# EAGLE schematic LSS Pro V0.2 BOTTOM (EAGLE 7.6.0)
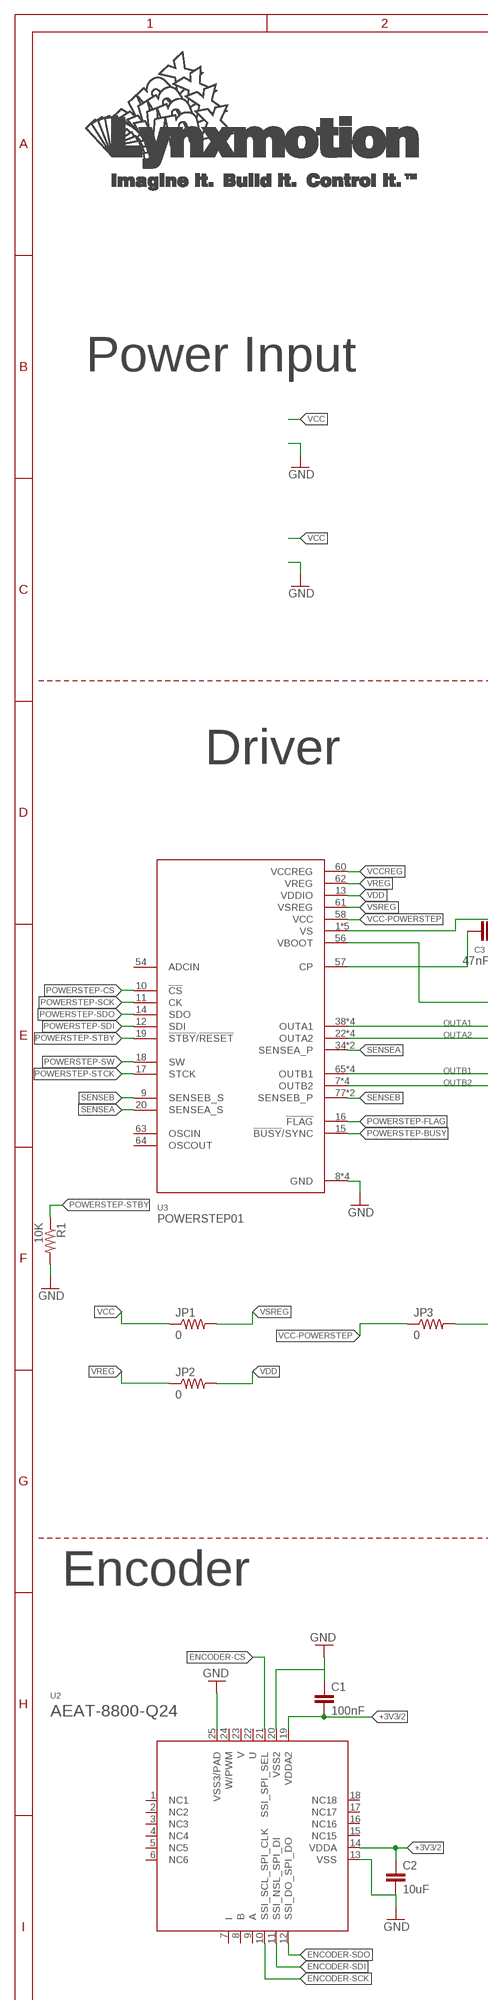
[diagram p0: schematic, sheet 1, part 1 of 2]
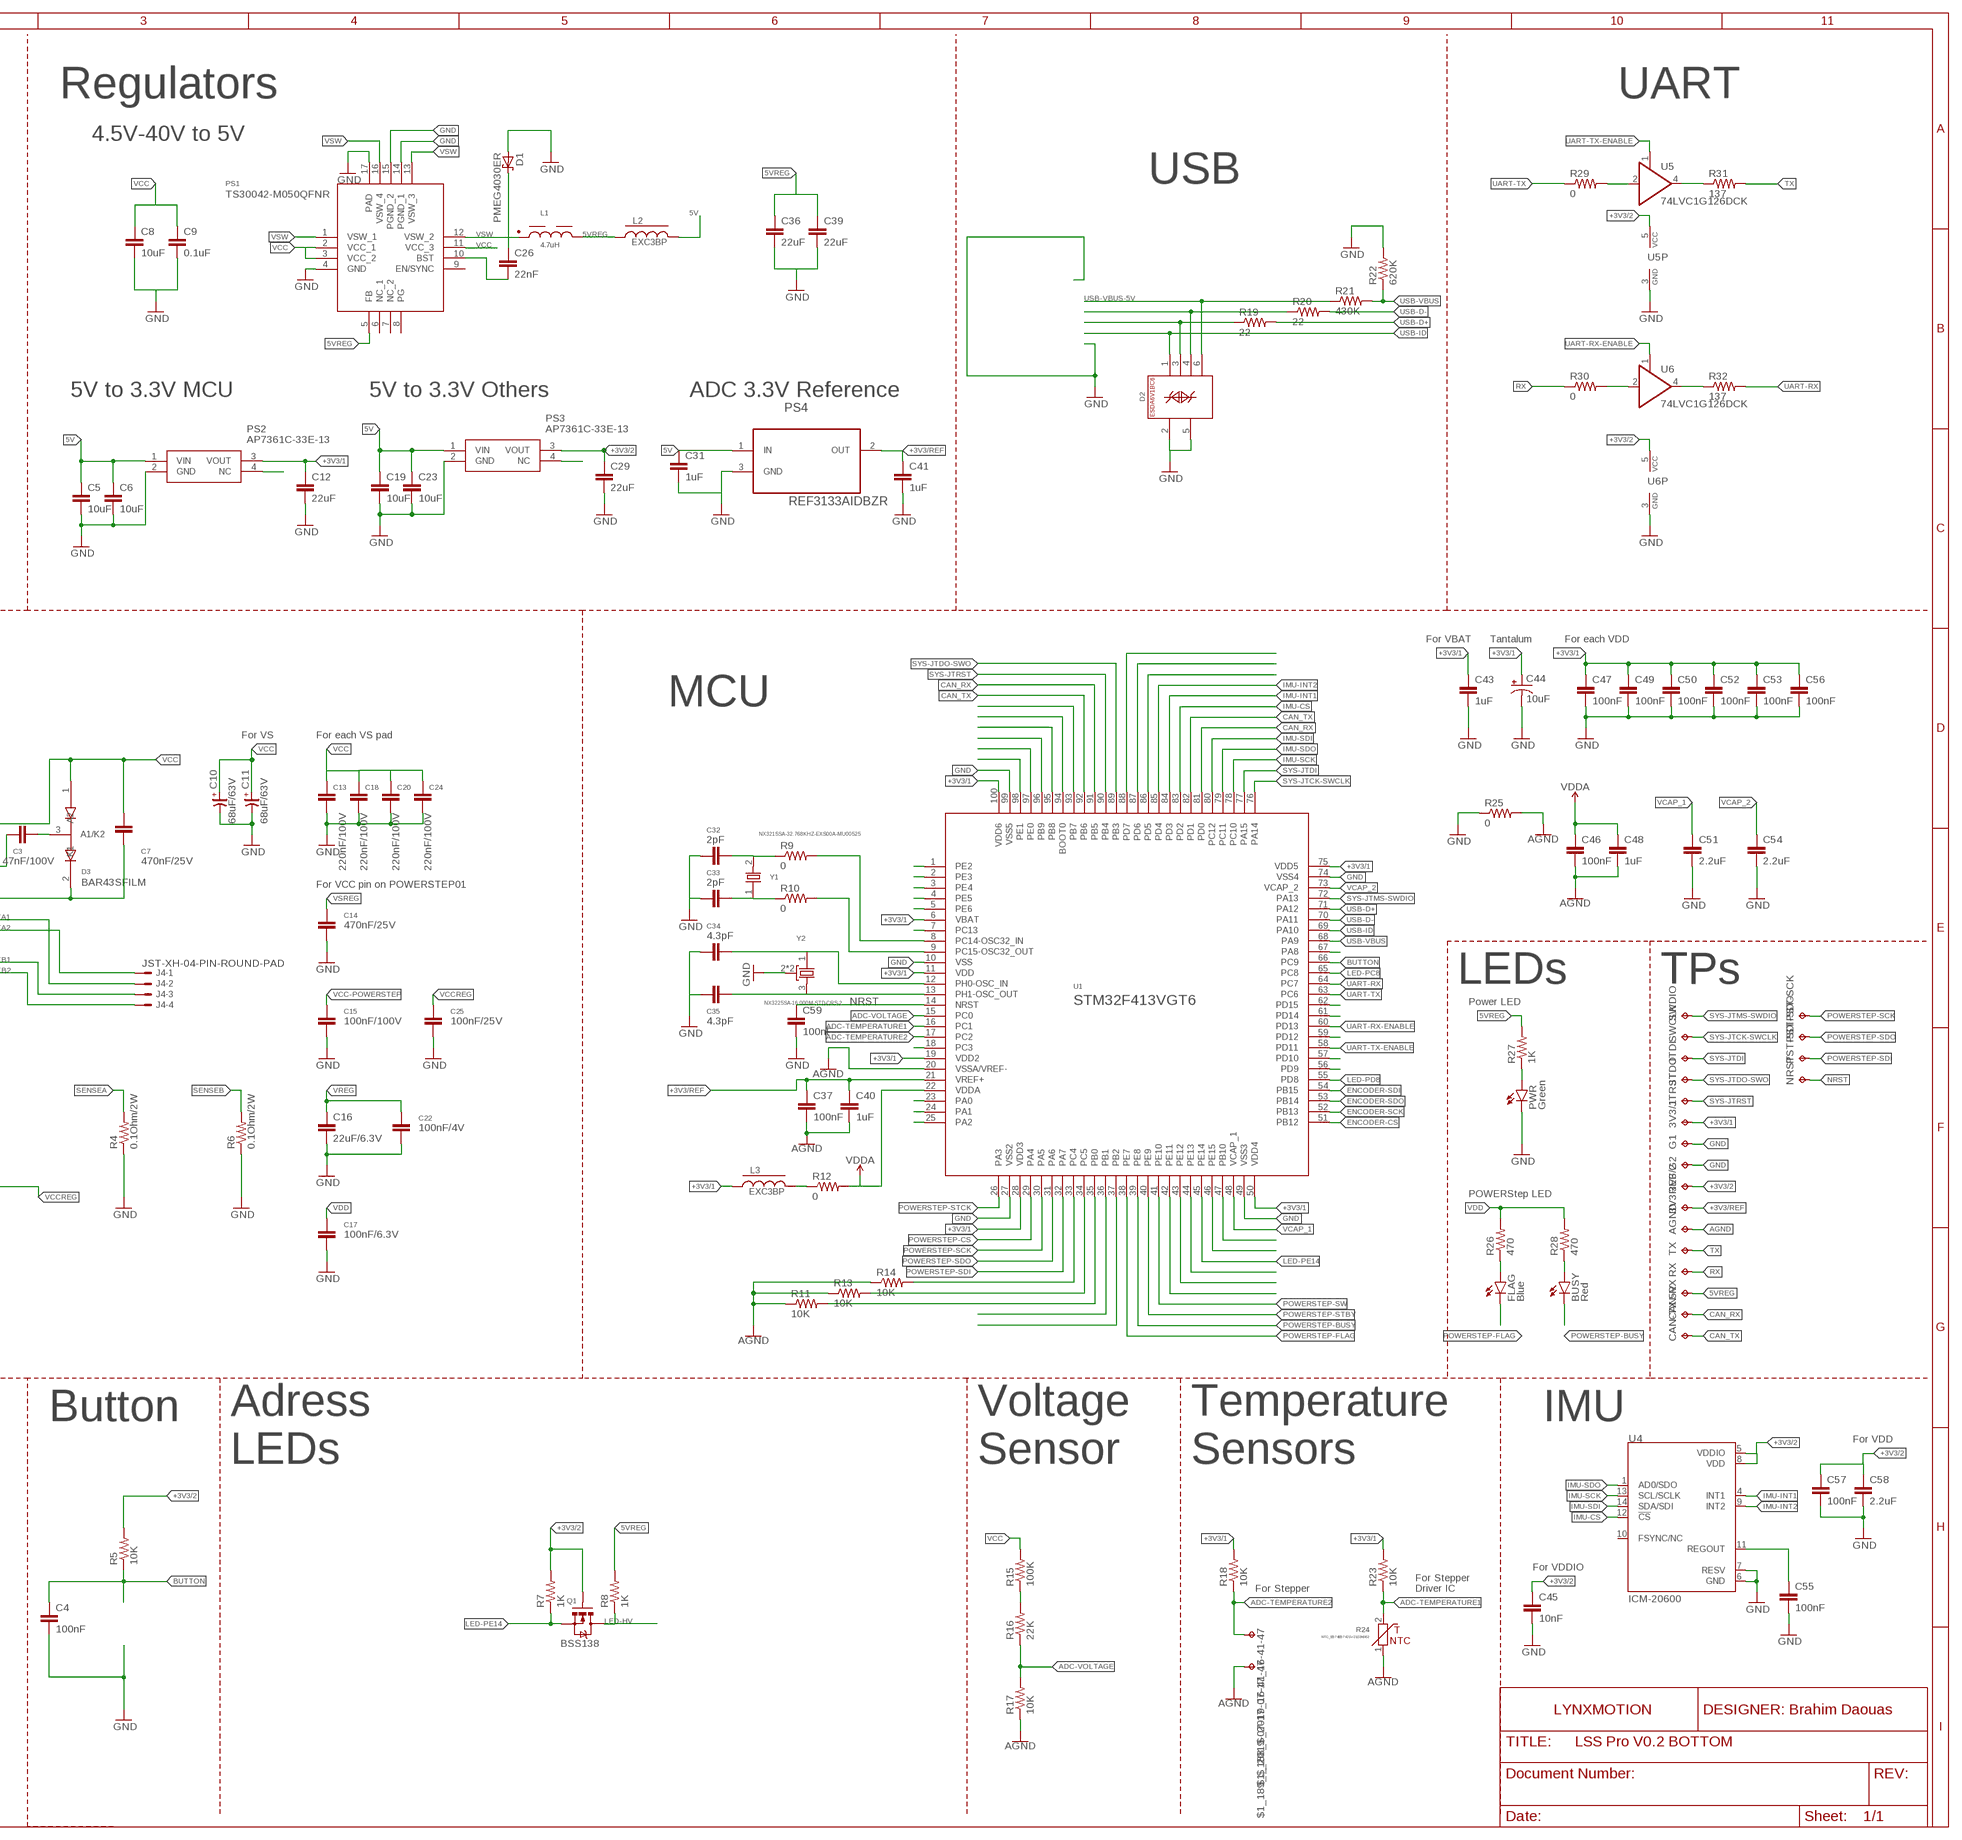
[diagram p1: schematic, sheet 1, part 2 of 2]

## Parts
3V3/1  TPTP17R  [TP17R]
3V3/2  TPTP17R  [TP17R]
3V3REF  TPTP17R  [TP17R]
5V  TPTP17R  [TP17R]
$1_188_$_2019-07-17_16-41-47  TP-040  [TP-040]
$1_189_$_2019-07-17_16-41-47  TP-040  [TP-040]
AGND  TPTP17R  [TP17R]
BUSY  Red  LED0603  [LED-0603]
C1  100nF  CAP0603-CAP  [0603-CAP]
C2  10uF  CAP0603-CAP  [0603-CAP]
C3  47nF/100V  CAP0805  [0805]
C4  100nF  CAP0603-CAP  [0603-CAP]
C5  10uF  CAP0805  [0805]
C6  10uF  CAP0805  [0805]
C7  470nF/25V  CAP0603-CAP  [0603-CAP]
C8  10uF  CAP1206  [1206]
C9  0.1uF  CAP0603-CAP  [0603-CAP]
C10  68uF/63V  CP_SV-E/F  [CSV-E/F]
C11  68uF/63V  CP_SV-E/F  [CSV-E/F]
C12  22uF  CAP0805  [0805]
C13  220nF/100V  CAP0805  [0805]
C14  470nF/25V  CAP0603-CAP  [0603-CAP]
C15  100nF/100V  CAP0603-CAP  [0603-CAP]
C16  22uF/6.3V  CAP1206  [1206]
C17  100nF/6.3V  CAP0603-CAP  [0603-CAP]
C18  220nF/100V  CAP0805  [0805]
C19  10uF  CAP0805  [0805]
C20  220nF/100V  CAP0805  [0805]
C22  100nF/4V  CAP0603-CAP  [0603-CAP]
C23  10uF  CAP0805  [0805]
C24  220nF/100V  CAP0805  [0805]
C25  100nF/25V  CAP0603-CAP  [0603-CAP]
C26  22nF  CAP0402-CAP  [0402-CAP]
C29  22uF  CAP0805  [0805]
C31  1uF  CAP0805  [0805]
C32  2pF  CAP0603-CAP  [0603-CAP]
C33  2pF  CAP0603-CAP  [0603-CAP]
C34  4.3pF  CAP0603-CAP  [0603-CAP]
C35  4.3pF  CAP0603-CAP  [0603-CAP]
C36  22uF  CAP0805  [0805]
C37  100nF  CAP0603-CAP  [0603-CAP]
C39  22uF  CAP0805  [0805]
C40  1uF  CAP0603-CAP  [0603-CAP]
C41  1uF  CAP0805  [0805]
C43  1uF  CAP0603-CAP  [0603-CAP]
C44  10uF  CAP_POL1206  [EIA3216]
C45  10nF  CAP0603-CAP  [0603-CAP]
C46  100nF  CAP0603-CAP  [0603-CAP]
C47  100nF  CAP0603-CAP  [0603-CAP]
C48  1uF  CAP0603-CAP  [0603-CAP]
C49  100nF  CAP0603-CAP  [0603-CAP]
C50  100nF  CAP0603-CAP  [0603-CAP]
C51  2.2uF  CAP1206  [1206]
C52  100nF  CAP0603-CAP  [0603-CAP]
C53  100nF  CAP0603-CAP  [0603-CAP]
C54  2.2uF  CAP1206  [1206]
C55  100nF  CAP0603-CAP  [0603-CAP]
C56  100nF  CAP0603-CAP  [0603-CAP]
C57  100nF  CAP0603-CAP  [0603-CAP]
C58  2.2uF  CAP1206  [1206]
C59  100nF  CAP0603-CAP  [0603-CAP]
CAN-RX  TPTP17R  [TP17R]
CAN-TX  TPTP17R  [TP17R]
D1  PMEG4030ER  [SOD123W]
D2  ESDA6V1BC6  [SOT-23-6L]
D3  BAR43SFILM  [SOT105P242X150-3N]
FLAG  Blue  LED0603  [LED-0603]
G1  TPTP17R  [TP17R]
G2  TPTP17R  [TP17R]
J4  JST-XH-04-PIN-ROUND-PAD  [JST-XH-04-PACKAGE-ROUND-PAD]
JP1  0  RESISTOR0603  [0603-RES]
JP2  0  RESISTOR0603  [0603-RES]
JP3  0  RESISTOR0603  [0603-RES]
JTDI  TPTP17R  [TP17R]
JTDO  TPTP17R  [TP17R]
JTRST  TPTP17R  [TP17R]
L1  4.7uH  WE-PD2_5848_744774047  [WE-PD2_5848/5820]
L2  EXC3BP  [L0603]
L3  EXC3BP  [L0603]
NRST  TPTP17R  [TP17R]
PS1  TS30042-M050QFNR  [QFN16]
PS2  AP7361C-33E-13  [SOT230P700X165-4N]
PS3  AP7361C-33E-13  [SOT230P700X165-4N]
PS4  REF3133AIDBZR  [SOT95P237X112-3N]
PST-SCK  TPTP17R  [TP17R]
PST-SDI  TPTP17R  [TP17R]
PST-SDO  TPTP17R  [TP17R]
PWR  Green  LED0603  [LED-0603]
Q1  BSS138  MOSFET-NCHANNELSMD  [SOT23-3]
R1  10K  RESISTOR0402-RES  [0402-RES]
R4  0.1Ohm/2W  RESISTOR2512  [R2512]
R5  10K  RESISTOR0603  [0603-RES]
R6  0.1Ohm/2W  RESISTOR2512  [R2512]
R7  1K  RESISTOR0603-RES  [0603-RES]
R8  1K  RESISTOR0603-RES  [0603-RES]
R9  0  RESISTOR0603  [0603-RES]
R10  0  RESISTOR0603  [0603-RES]
R11  10K  RESISTOR0402-RES  [0402-RES]
R12  0  RESISTOR0603  [0603-RES]
R13  10K  RESISTOR0402-RES  [0402-RES]
R14  10K  RESISTOR0402-RES  [0402-RES]
R15  100K  RESISTOR0603-RES  [0603-RES]
R16  22K  RESISTOR0603-RES  [0603-RES]
R17  10K  RESISTOR0603-RES  [0603-RES]
R18  10K  10KOHM-1/10W-1%(0603)0603  [0603-RES]
R19  22  RESISTOR0603  [0603-RES]
R20  22  RESISTOR0603  [0603-RES]
R21  430K  RESISTOR0603  [0603-RES]
R22  620K  RESISTOR0603  [0603-RES]
R23  10K  10KOHM-1/10W-1%(0603)0603  [0603-RES]
R24  NTC_B574B57421V2102H062  [R0805]
R25  0  RESISTOR0603  [0603-RES]
R26  470  RESISTOR0402-RES  [0402-RES]
R27  1K  RESISTOR0402-RES  [0402-RES]
R28  470  RESISTOR0402-RES  [0402-RES]
R29  0  RESISTOR0603  [0603-RES]
R30  0  RESISTOR0603  [0603-RES]
R31  137  RESISTOR0603  [0603-RES]
R32  137  RESISTOR0603  [0603-RES]
RX  TPTP17R  [TP17R]
SWCLK  TPTP17R  [TP17R]
SWDIO  TPTP17R  [TP17R]
TX  TPTP17R  [TP17R]
U1  STM32F413VGT6  [LQFP100]
U2  AEAT-8800-Q24  [QFN24]
U3  POWERSTEP01  [IC_POWERSTEP01]
U4  ICM-20600  [PQFN50P250X300X97-14N]
U5  74LVC1G126DCK  [SC70-5]
U6  74LVC1G126DCK  [SC70-5]
Y1  NX3215SA-32.768KHZ-EXS00A-MU00525  [NX3215SA]
Y2  NX3225SA-16.000M-STD-CRS-2  [OSCCC320X250X60N]

## Nets
5V: C5.1 C6.1 C19.1 C23.1 C31.1 L2.2 PS2.1(VIN) PS3.1(VIN) PS4.1(IN)
5VREG: 5V.TP C36.1 C39.1 L1.2 L2.1 PS1.5(FB) R8.2 R27.2
+3V3/1: 3V3/1.TP C12.1 C43.1 C44.A(+) C47.1 C49.1 C50.1 C52.1 C53.1 C56.1 L3.1 PS2.3(VOUT) R18.2 R23.2 U1.6(VBAT) U1.11(VDD) U1.19(VDD2) U1.28(VDD3) U1.50(VDD4) U1.75(VDD5) U1.100(VDD6)
+3V3/2: 3V3/2.TP C1.2 C2.1 C29.1 C45.1 C57.1 C58.1 PS3.3(VOUT) Q1.1(G) R5.2 R7.2 U2.14(VDDA) U2.19(VDDA2) U4.5(VDDIO) U4.8(VDD) U5.5(VCC) U6.5(VCC)
+3V3/REF: 3V3REF.TP C37.1 C40.1 C41.1 PS4.2(OUT) U1.21(VREF+)
ADC-TEMPERATURE1: R23.1 R24.2 U1.16(PC1)
ADC-TEMPERATURE2: $1_188_$_2019-07-17_16-41-47.1 R18.1 U1.17(PC2)
ADC-VOLTAGE: R16.1 R17.2 U1.15(PC0)
AGND: $1_189_$_2019-07-17_16-41-47.1 AGND.TP C37.2 C40.2 C46.2 C48.2 R11.1 R13.1 R14.1 R17.1 R24.1 R25.2 U1.20(VSSA/VREF-)
BUTTON: C4.1 R5.1 U1.66(PC9)
CAN_RX: CAN-RX.TP U1.81(PD0) U1.91(PB5)
CAN_TX: CAN-TX.TP U1.82(PD1) U1.92(PB6)
ENCODER-CS: U1.51(PB12) U2.21(SSI_SPI_SEL)
ENCODER-SCK: U1.52(PB13) U2.10(SSI_SCL_SPI_CLK)
ENCODER-SDI: U1.54(PB15) U2.11(SSI_NSL_SPI_DI)
ENCODER-SDO: U1.53(PB14) U2.12(SSI_DO_SPI_DO)
GND: C1.1 C2.2 C4.2 C5.2 C6.2 C8.2 C9.2 C10.- C11.- C12.2 C13.2 C14.2 C15.2 C16.2 C17.2 C18.2 C19.2 C20.2 C22.2 C23.2 C24.2 C25.2 C29.2 C31.2 C32.2 C33.2 C34.2 C35.2 C36.2 C39.2 C41.2 C43.2 C44.C(-) C45.2 C47.2 C49.2 C50.2 C51.2 C52.2 C53.2 C54.2 C55.2 C56.2 C57.2 C58.2 C59.2 D1.2(A) D2.2 D2.5 G1.TP G2.TP PS1.4(GND) PS1.14(PGND_1) PS1.15(PGND_2) PS1.17(PAD) PS2.2(GND) PS3.2(GND) PS4.3(GND) PWR.C R1.2 R4.1 R6.1 R22.2 R25.1 U1.10(VSS) U1.27(VSS2) U1.49(VSS3) U1.74(VSS4) U1.99(VSS5) U2.13(VSS) U2.20(VSS2) U2.25(VSS3/PAD) U3.8(GND) U3.21(GND) U3.59(GND) U3.EPAD9(GND) U4.6(GND) U4.7(RESV) U5.3(GND) U6.3(GND) Y2.2(GND) Y2.4(GND)
IMU-CS: U1.83(PD2) U4.12(!CS)
IMU-INT1: U1.84(PD3) U4.4(INT1)
IMU-INT2: U1.85(PD4) U4.9(INT2)
IMU-SCK: U1.78(PC10) U4.13(SCL/SCLK)
IMU-SDI: U1.80(PC12) U4.14(SDA/SDI)
IMU-SDO: U1.79(PC11) U4.1(AD0/SDO)
LED-HV: Q1.3(D) R8.1
LED-PC8: U1.65(PC8)
LED-PD8: U1.55(PD8)
LED-PE14: Q1.2(S) R7.1 U1.45(PE14)
N$1: U1.1(PE2)
N$2: U1.2(PE3)
N$3: U1.3(PE4)
N$4: U1.4(PE5)
N$5: U1.5(PE6)
N$6: R30.2 U6.2(I)
N$7: U1.7(PC13)
N$8: R9.2 U1.8(PC14-OSC32_IN)
N$9: R10.2 U1.9(PC15-OSC32_OUT)
N$10: L3.2 R12.1
N$11: R32.1 U6.4(O)
N$12: C34.1 U1.12(PH0-OSC_IN) Y2.1
N$13: C35.1 U1.13(PH1-OSC_OUT) Y2.3
N$15: PWR.A R27.1
N$18: U1.18(PC3)
N$20: R29.2 U5.2(I)
N$21: U1.37(PB2)
N$22: R31.1 U5.4(O)
N$23: U1.23(PA0)
N$24: U1.24(PA1)
N$25: U1.25(PA2)
N$27: C32.1 R9.1 Y1.2
N$28: C33.1 R10.1 Y1.1
N$29: FLAG.A R26.1
N$34: U1.67(PA8)
N$36: C3.1 U3.57(CP)
N$37: R15.1 R16.2
N$39: U1.62(PD15)
N$40: U1.61(PD14)
N$42: U1.59(PD12)
N$44: U1.57(PD10)
N$45: U1.56(PD9)
N$46: C55.1 U4.11(REGOUT)
N$47: BUSY.A R28.1
N$48: D2.4 R20.1
N$49: D2.3 R19.1
N$53: PS2.4(NC)
N$54: PS3.4(NC)
N$61: U1.86(PD5)
N$62: U1.87(PD6)
N$63: U1.88(PD7)
N$66: U1.98(PE1)
N$67: U1.97(PE0)
N$68: U1.96(PB9)
N$69: U1.95(PB8)
N$70: U1.94(BOOT0)
N$71: U1.93(PB7)
N$78: C3.2 D3.3(A1/K2)
N$83: R14.2 U1.33(PC4)
N$84: R13.2 U1.34(PC5)
N$85: R11.2 U1.35(PB0)
N$86: U1.36(PB1)
N$89: C7.2 D3.2(K1) U3.56(VBOOT)
N$92: U1.47(PB10)
N$93: U1.46(PE15)
N$95: U1.44(PE13)
N$96: U1.43(PE12)
N$97: U1.42(PE11)
N$101: C26.2 PS1.10(BST)
NRST: C59.1 NRST.TP U1.14(NRST)
OUTA1: J4.2 U3.38(OUTA1) U3.42(OUTA1) U3.53(OUTA1) U3.EPAD4(OUTA1)
OUTA2: J4.1 U3.22(OUTA2) U3.33(OUTA2) U3.37(OUTA2) U3.EPAD3(OUTA2)
OUTB1: J4.3 U3.65(OUTB1) U3.76(OUTB1) U3.80(OUTB1) U3.EPAD7(OUTB1)
OUTB2: J4.4 U3.7(OUTB2) U3.81(OUTB2) U3.85(OUTB2) U3.EPAD8(OUTB2)
POWERSTEP-BUSY: BUSY.C U1.39(PE8) U3.15(!BUSY!/SYNC)
POWERSTEP-CS: U1.29(PA4) U3.10(!CS)
POWERSTEP-FLAG: FLAG.C U1.38(PE7) U3.16(!FLAG)
POWERSTEP-SCK: PST-SCK.TP U1.30(PA5) U3.11(CK)
POWERSTEP-SDI: PST-SDI.TP U1.32(PA7) U3.12(SDI)
POWERSTEP-SDO: PST-SDO.TP U1.31(PA6) U3.14(SDO)
POWERSTEP-STBY: R1.1 U1.40(PE9) U3.19(!STBY!/!RESET)
POWERSTEP-STCK: U1.26(PA3) U3.17(STCK)
POWERSTEP-SW: U1.41(PE10) U3.18(SW)
RX: R30.1 RX.TP
SENSEA: R4.2 U3.20(SENSEA_S) U3.34(SENSEA_P) U3.39(SENSEA_P)
SENSEB: R6.2 U3.9(SENSEB_S) U3.77(SENSEB_P) U3.82(SENSEB_P)
SYS-JTCK-SWCLK: SWCLK.TP U1.76(PA14)
SYS-JTDI: JTDI.TP U1.77(PA15)
SYS-JTDO-SWO: JTDO.TP U1.89(PB3)
SYS-JTMS-SWDIO: SWDIO.TP U1.72(PA13)
SYS-JTRST: JTRST.TP U1.90(PB4)
TX: R31.2 TX.TP
UART-RX: R32.2 U1.64(PC7)
UART-RX-ENABLE: U1.60(PD13) U6.1(OE)
UART-TX: R29.1 U1.63(PC6)
UART-TX-ENABLE: U1.58(PD11) U5.1(OE)
USB-D+: R19.2 U1.71(PA12)
USB-D-: R20.2 U1.70(PA11)
USB-ID: D2.1 U1.69(PA10)
USB-VBUS: R21.2 R22.1 U1.68(PA9)
USB-VBUS-5V: D2.6 R21.1
VCAP_1: C51.1 U1.48(VCAP_1)
VCAP_2: C54.1 U1.73(VCAP_2)
VCC: C7.1 C8.1 C9.1 C10.+ C11.+ C13.1 C18.1 C20.1 C24.1 D3.1(A2) JP1.1 PS1.2(VCC_1) PS1.3(VCC_2) PS1.11(VCC_3) R15.2 U3.1(VS) U3.23(VS) U3.43(VS) U3.55(VS) U3.66(VS)
VCC-POWERSTEP: C15.1 JP3.1 U3.58(VCC)
VCCREG: C25.1 JP3.2 U3.60(VCCREG)
VDD: C17.1 JP2.2 R26.2 R28.2 U3.13(VDDIO)
VDDA: C46.1 C48.1 R12.2 U1.22(VDDA)
VREG: C16.1 C22.1 JP2.1 U3.62(VREG)
VSREG: C14.1 JP1.2 U3.61(VSREG)
VSW: C26.1 D1.1(K) L1.1 PS1.1(VSW_1) PS1.12(VSW_2) PS1.13(VSW_3) PS1.16(VSW_4)
Unconnected: PS1.6(NC_1) PS1.7(NC_2) PS1.8(PG) PS1.9(EN/SYNC) U2.1(NC1) U2.2(NC2) U2.3(NC3) U2.4(NC4) U2.5(NC5) U2.6(NC6) U2.7(I) U2.8(B) U2.9(A) U2.15(NC15) U2.16(NC16) U2.17(NC17) U2.18(NC18) U2.22(U) U2.23(V) U2.24(W/PWM) U3.54(ADCIN) U3.63(OSCIN) U3.64(OSCOUT) U4.10(FSYNC/NC)

## Notes on the sheet
- Regulators | UART
- 4.5V-40V to 5V
- USB
- Power Input
- 5V to 3.3V MCU | 5V to 3.3V Others | ADC 3.3V Reference
- For VBAT | Tantalum | For each VDD
- Driver
- MCU
- For VS | For each VS pad
- For VCC pin on POWERSTEP01
- LEDs | TPs
- Power LED
- POWERStep LED
- Encoder | Button | IMU
- For VDD
- Adress
  LEDs
- Voltage 
  Sensor
- Temperature
  Sensors
- For VDDIO
- For Stepper
- For Stepper
  Driver IC

## Library data of the parts
3V3/1 3V3/2 3V3REF 5V AGND CAN-RX CAN-TX G1 G2 JTDI JTDO JTRST NRST PST-SCK PST-SDI PST-SDO RX SWCLK SWDIO TX = testpad:TP: Test pad
$1_188_$_2019-07-17_16-41-47 $1_189_$_2019-07-17_16-41-47 = Test Points:TP: TEST POINT PCB Vertical Mount
BUSY FLAG PWR = SparkFun-LED:LED: LEDs Standard schematic elements and footprints for 5mm, 3mm, 1206, and 0603 sized LEDs. 5mm - Spark Fun Electronics SKU : COM-00529 (and others)
C1-C9 C12-C20 C22-C26 C29 C31-C37 C39-C41 C43 C45-C59 = SparkFun-Capacitors:CAP: Capacitor Standard 0603 ceramic capacitor, and 0.1" leaded capacitor.
C10 C11 = rc-master-smd:CP_: POLARIZED CAP
C44 = SparkFun-Capacitors:CAP_POL: Capacitor Polarized These are standard SMD and PTH capacitors. Normally 10uF, 47uF, and 100uF in electrolytic and tantalum varieties. Always verify the external diameter of the through hole cap, it varies with capacity, voltage, and manufacturer. The EIA devices should be standard.
D1 = nxp_60_1_1:PMEG4030E: 40 V, 3 A low VF MEGA Schottky barrier rectifier Planar Maximum Efficiency General Application (MEGA) Schottky barrier rectifier with an integrated guard ring for stress protection. AAL Eindhoven MK
D2 = FaBo-Supply:ESDA6V1BC6
D3 = BAR43SFILM:BAR43SFILM: BAR43SFILM, Schottky Diode, 0.1A max, 30V 5ns Dual, 3-Pin, SOT-23 Source: Datasheet <http://www.st.com/st-web-ui/static/active/en/resource/technical/document/datasheet/CD00000764.pdf>; ALLIED_NUMBER: 70013846; ALLIED_PRICE-STOCK: http://www.alliedelec.com/stmicroelectronics-bar43sfilm/70013846/; DESCRIPTION: BAR43SFILM, Schottky Diode, 0.1A max, 30V 5ns Dual, 3-Pin, SOT-23; HEIGHT: 1.5mm; MANUFACTURER_NAME: STMicroelectronics; MANUFACTURER_PART_NUMBER: BAR43SFILM; MOUSER_PART_NUMBER: 511-BAR43SFILM; MOUSER_PRICE-STOCK: https://www.mouser.com/Search/Refine.aspx?Keyword=511-BAR43SFILM; RS_PART_NUMBER: 4384762; RS_PRICE-STOCK: http://uk.rs-online.com/web/p/products/4384762
J4 = JST XH Connectors v1-0:JST-XH-04-PIN: JST XH Connector 2 Pin Wire to board connector. Pitch: 2,54 mm, (0.100") Number of pins: 4 Created by Rembrandt Electronics www.rembrandtelectronics.com
JP1-JP3 R4-R10 R12 R15-R17 R19-R22 R25 R29-R32 = SparkFun-Resistors:RESISTOR: Resistor Basic schematic elements and footprints for 0603, 1206, and PTH resistors.
L1 = EMCComponents (rev19b):WE-PD2_5848: SMD Power Inductor Characteristics Open size Saturation currents up to 14 A Low tolerances at high inductance values Operating temperature: –40 °C to +125 °C Applications Integrated DC/DC-converter Switching regulators with low operating voltages (Graphic cards, embedded PC-Cards, Mainboards) Optimal attenuation in MHz frequency range <http://katalog.we-online.de/media/images/v2/Family_WE-PD2.jpg> Details see: http://katalog.we-online.de/en/pbs/WE-PD2 Updated by Dan Xu 2014-07-08 2014 (C) Wurth Elektronik; WE-NUMBER: 744774047/4,7uH
L2 L3 = ferrite:EXC3BP: Chip Bead Core
PS1 = LSS_Pro:TS30042-M050QFNR
PS2 PS3 = AP7361C-33E-13:AP7361C-33E-13: 1A LOW DROPOUT ADJUSTABLE AND FIXED-MODE REGULATOR WITH ENABLE Source: Datasheet <https://www.diodes.com/assets/Datasheets/AP7361C.pdf>; DESCRIPTION: 1A LOW DROPOUT ADJUSTABLE AND FIXED-MODE REGULATOR WITH ENABLE; HEIGHT: 1.65mm; MANUFACTURER_NAME: Diodes Inc.; MANUFACTURER_PART_NUMBER: AP7361C-33E-13
PS4 = REF3133AIDBZR:REF3133AIDBZR: SERIES VOLTAGE REFERENCE; AVAILABILITY: Unavailable; DESCRIPTION: 20ppm/°C Max, 100µA, SOT23-3 Series Voltage Reference 3-SOT-23 -40 to 125; MF: Texas Instruments; MP: REF3133AIDBZR; PACKAGE: SOT-23-3 Texas Instruments; PRICE: None
Q1 = SparkFun:MOSFET-NCHANNEL
R1 R11 R13 R14 R26-R28 = SparkFun-Passives:RESISTOR: Resistor Basic schematic elements and footprints for 0603, 1206, and PTH resistors.
R18 R23 = SparkFun-Resistors:10KOHM-1/10W-1%(0603): RES-00824; PROD_ID: RES-00824
R24 = Temperature2:NTC_B574: THERMISTOR, NTC, 0805, 1K, NICKEL B57421V2102J062 Parameters Thermistor Type: NTC Resistance: 1kohm Thermistor Tolerance: -5% to +5% Beta Value (K): 4000K Thermistor Case Style: 0805 [2012 Metric] No. of Pins: 2 Operating Temperature Min: -55°C Operating Temperature Max: +125°C SVHC: No SVHC (20-Jun-2013) Beta Value Lower Limit Temperature: 25°C Power Dissipation Ptot Max: 210mW Resistance Tolerance: ± 5% Series: B574 Temperature Upper Limit Beta Value: 100°C; MPN: B57421V2102H062; OC_FARNELL: 1299919; PACKAGE: SMD0805; SUPPLIER: EPCOS
U1 = LSS_Pro:STM32F413VGT6: STM32F413RG ARM® Cortex®-M4 STM32F4 Microcontroller IC 32-Bit 100MHz 1MB (1M x 8) FLASH 64-LQFP (10x10)
U2 = LSS_Pro:AEAT-8800-Q24: 16-BIT PROG ANG ENCODER
U3 = LSS_Pro:POWERSTEP01: powerSTEP01 Series 5V 10A System-in-Package Integrating Microstepping Controller; AVAILABILITY: Unavailable; DESCRIPTION: powerSTEP01 Series 5V 10A System-in-Package Integrating Microstepping Controller; MF: STMicroelectronics; MP: POWERSTEP01; PACKAGE: PowerVFQFN-89 STMicroelectronics; PRICE: None
U4 = ICM-20600:ICM-20600: Low-Power, High-Performance Integrated 6-Axis MEMS MotionTracking Device in 2.5mm x 3mm Package; AVAILABILITY: Unavailable; DESCRIPTION: Low-Power, High-Performance Integrated 6-Axis MEMS MotionTracking Device in 2.5mm x 3mm Package; MF: TDK InvenSense; MP: ICM-20600; PACKAGE: PQFN-14N TDK-InvenSense; PRICE: None
U5 U6 = 74xx-little-de:74*1G126: Single Bus Buffer Gate With 3-State Outputs
Y1 = LSS_Pro:NX3215SA-32.768KHZ-EXS00A-MU00525: NX3215SA-32.768KHZ-EXS00A-MU00525 CRYSTAL 32.768KHZ 6PF SMD; DESCRIPTION: Crsytal unit for OA/AV/Mobile communications/Automotive; HEIGHT: mm; MANUFACTURER_NAME: NDK; MANUFACTURER_PART_NUMBER: NX3215SA-32.768K-STD-MUA-8; MOUSER_PART_NUMBER: 344-NX3215SA32768K8; MOUSER_PRICE-STOCK: https://www.mouser.com/Search/Refine.aspx?Keyword=344-NX3215SA32768K8; RS_PART_NUMBER: 7537568; RS_PRICE-STOCK: https://uk.rs-online.com/web/p/products/7537568
Y2 = LSS_Pro:NX3225SA-16.000M-STD-CRS-2: Crystal 12.0000mhz 8pf Smd; AVAILABILITY: Unavailable; DESCRIPTION: Crystal 12.0000mhz 8pf Smd; MF: NDK America,; MP: NX3225SA-12.000M-STD-CRS-2; PACKAGE: SMD-4 NDK America; PRICE: None

## Net classes
1 vcc: width 0.305 mm
2 Power: width 0.203 mm, drill 0.305 mm, clearance 0.152 mm to class 0, clearance 0.152 mm to class 1, clearance 0.152 mm
3 usb diff pairs: width 0.254 mm